# EAGLE design writecard (EAGLE 7.2.0)
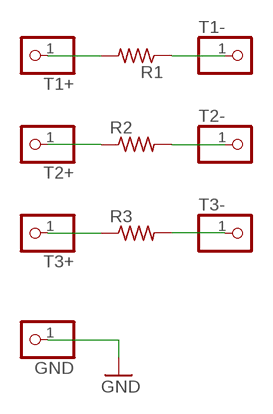
[diagram p0: schematic, sheet 1]

## Parts
GND  PINHD-1X1  [1X01]
R1  R-US_R2512  [R2512]
R2  R-US_R2512  [R2512]
R3  R-US_R2512  [R2512]
T1+  PINHD-1X1  [1X01]
T1-  PINHD-1X1  [1X01]
T2+  PINHD-1X1  [1X01]
T2-  PINHD-1X1  [1X01]
T3+  PINHD-1X1  [1X01]
T3-  PINHD-1X1  [1X01]

## Nets
GND: GND.1
N$1: R1.1 T1-.1
N$2: R1.2 T1+.1
N$3: R3.1 T3+.1
N$4: R2.1 T2+.1
N$5: R2.2 T2-.1
N$6: R3.2 T3-.1

## Library data of the parts
GND T1+ T1- T2+ T2- T3+ T3- = pinhead:PINHD-1X1: PIN HEADER
R1-R3 = resistor:R-US_: RESISTOR, American symbol

## Board
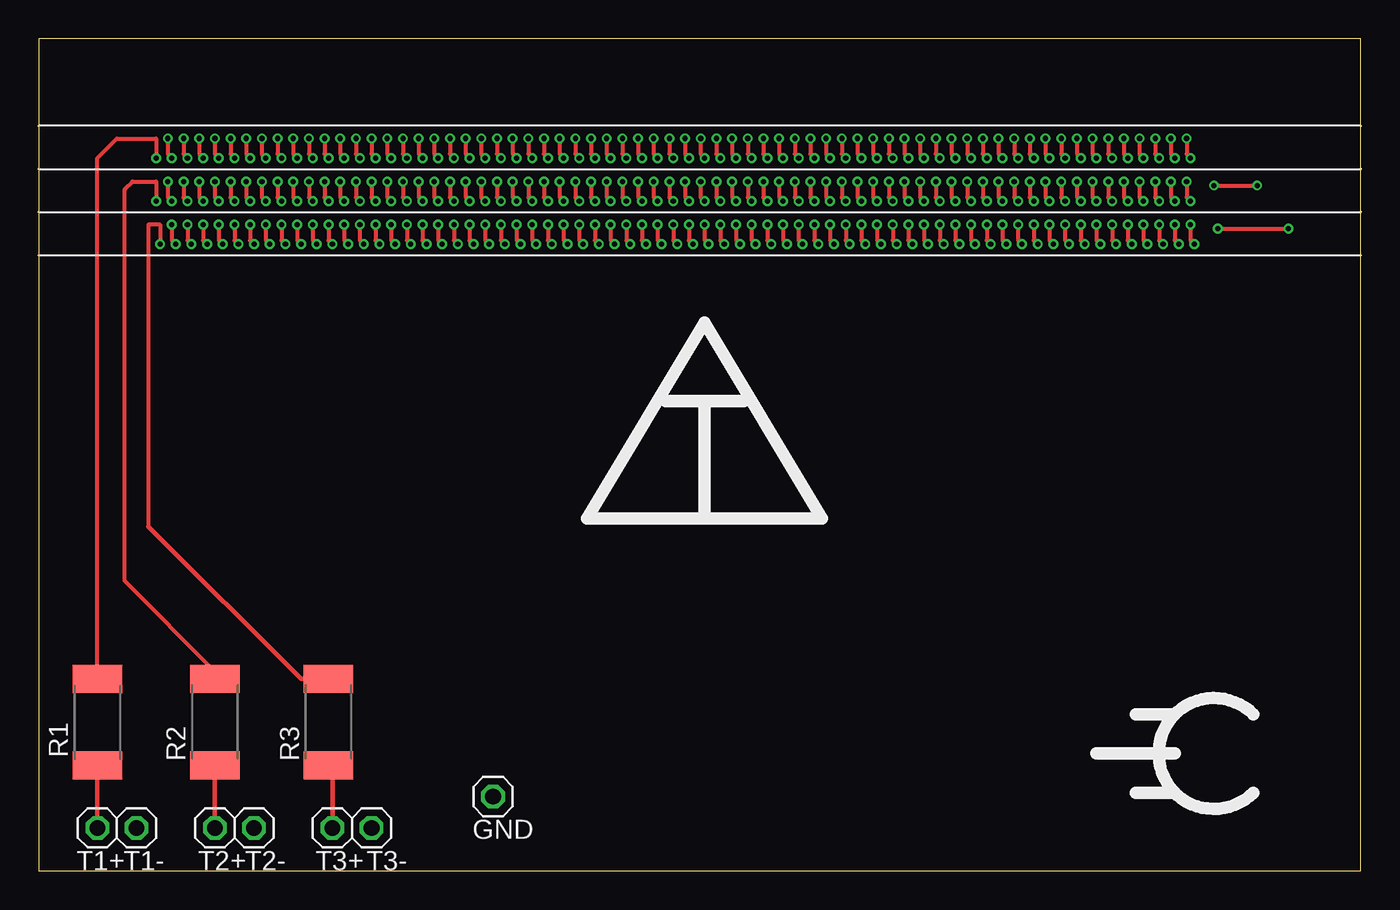
[diagram p1: board, top side]
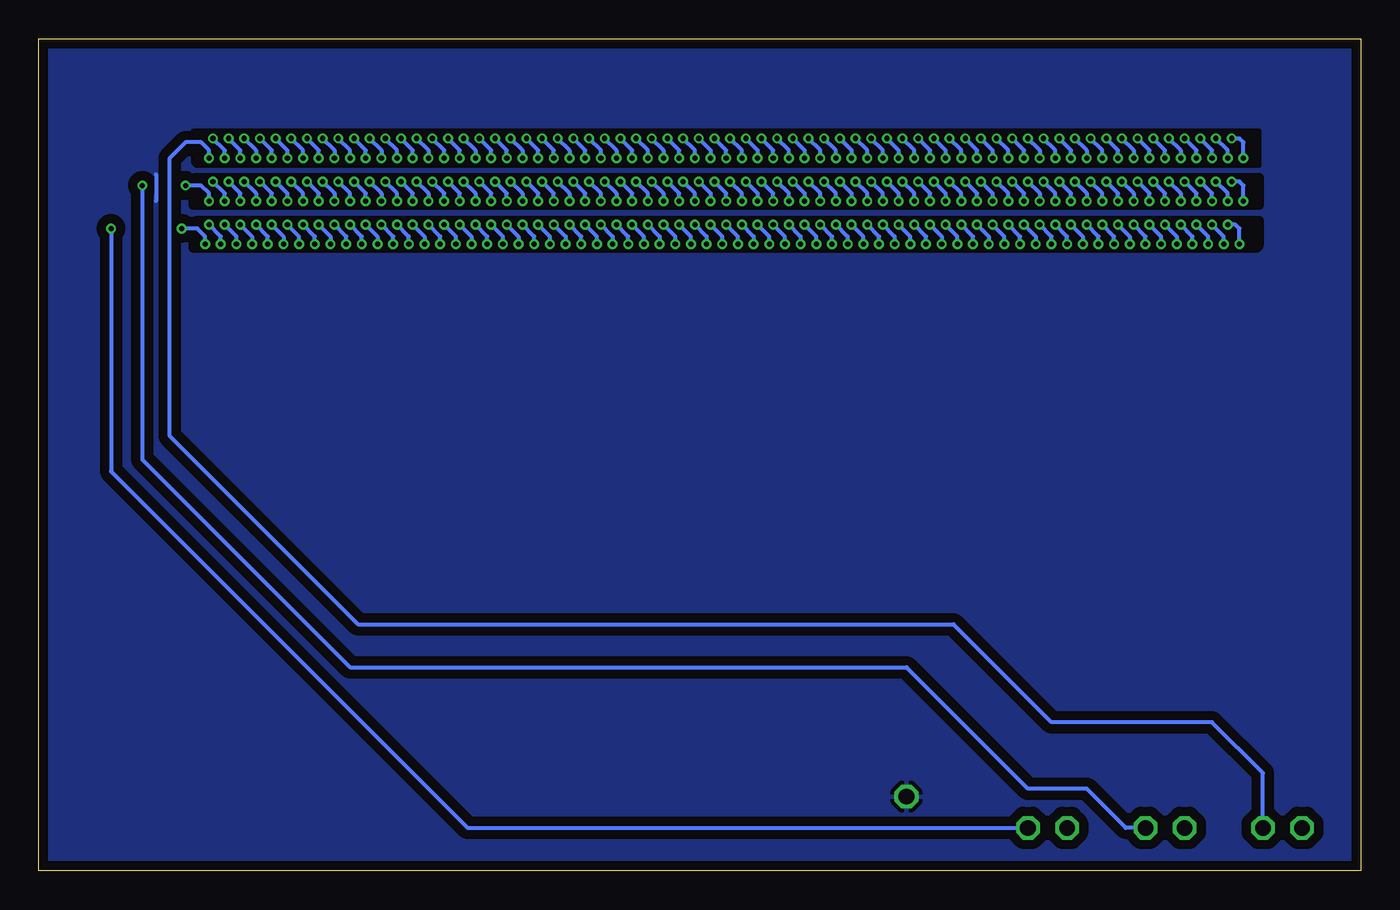
[diagram p2: board, bottom side, seen from below]

Size 85.72 x 53.98 mm. Coordinates in mm from the lower left corner, seen from the top.
Outline: 0,0 85.72,0 85.72,53.98 0,53.98 0,0
Copper layers (1*16): Top 0.035mm / dielectric 1.6mm / Bottom 0.035mm
Design rules "Elecrow_2-layer_PCB_eagle_rule *": minimum track width 6mil, minimum drill 12mil, track to track 8mil, track to pad 8mil, pad to pad 12mil, via to via 12mil, smd to smd 0mil, copper to edge 20mil, drill to drill 10mil, minimum pad ring 6mil, minimum via ring 6mil, stop-mask expansion 0mil, vias tented up to drill 100mil, thermal gap 10mil

### Footprints (pad centres in the part's own frame; a part is rotated, then mirrored left to right if it is on the bottom)
1X01 = drill 1.016 octagon: 1 0,0
R2512 = smd 1.8 x 3.2: 1 -2.8,0; 2 2.8,0

### Placement (x,y rotation side)
GND  29.46,4.83 0 top
R1  3.81,9.65 270 top
R2  11.43,9.65 90 top
R3  18.8,9.65 90 top
T1+  3.81,2.79 0 top
T1-  6.35,2.79 0 top
T2+  11.43,2.79 0 top
T2-  13.97,2.79 0 top
T3+  19.05,2.79 0 top
T3-  21.59,2.79 0 top

### Tracks (layer width: path | path; a pad name or v marks a point on that pad's centre or on a via)
GND
  Bottom 0.254: 78.11,45.16 78.11,43.43
  pour Bottom (isolate 0.61, rank 6): 0,0 0,54.1 85.34,54.1 arc-90 85.6,53.85 85.6,31.75 arc-90 85.6,31.5 85.6,0
  cutout Bottom: 6.6,43.18 6.6,44.96 75.44,44.96 arc-90 75.69,44.7 75.69,43.43 75.69,43.18
  cutout Bottom: 6.6,42.16 75.44,42.16 arc-90 75.69,41.91 75.69,40.39 6.86,40.39 arc-90 6.6,40.64
  pour Bottom (rank 2): 5.33,49.28 5.33,38.86 5.59,38.61 75.69,38.61 75.69,49.02 75.44,49.28
  cutout Bottom: 6.6,48.01 6.6,45.72 75.44,45.72 arc90 75.69,46.23 75.69,48.01
N$1  (via drill 0.33 pad 0.18)
  Top 0.254: v7.62,46.23 7.62,47.5 5.08,47.5 3.81,46.23 R1.1 | v8.38,47.5 8.38,46.48 v8.64,46.23 | v9.4,47.5 9.4,46.48 v9.65,46.23 | v10.41,47.5 10.41,46.48 v10.67,46.23 | v11.43,47.5 11.43,46.48 v11.68,46.23 | v12.45,47.5 12.45,46.48 v12.7,46.23 | v13.46,47.5 13.46,46.48 v13.72,46.23 | v14.48,47.5 14.48,46.48 v14.73,46.23 | v15.49,47.5 15.49,46.48 v15.75,46.23 | v16.51,47.5 16.51,46.48 v16.76,46.23 | v17.53,47.5 17.53,46.48 v17.78,46.23 | v18.54,47.5 18.54,46.48 v18.8,46.23 | v19.56,47.5 19.56,46.48 v19.81,46.23 | v20.57,47.5 20.57,46.48 v20.83,46.23 | v21.59,47.5 21.59,46.48 v21.84,46.23 | v22.61,47.5 22.61,46.48 v22.86,46.23 | v23.62,47.5 23.62,46.48 v23.88,46.23 | v24.64,47.5 24.64,46.48 v24.89,46.23 | v25.65,47.5 25.65,46.48 v25.91,46.23 | v26.67,47.5 26.67,46.48 v26.92,46.23 | v27.69,47.5 27.69,46.48 v27.94,46.23 | v28.7,47.5 28.7,46.48 v28.96,46.23 | v29.72,47.5 29.72,46.48 v29.97,46.23 | v30.73,47.5 30.73,46.48 v30.99,46.23 | v31.75,47.5 31.75,46.48 v32,46.23 | v32.77,47.5 32.77,46.48 v33.02,46.23 | v33.78,47.5 33.78,46.48 v34.04,46.23 | v34.8,47.5 34.8,46.48 v35.05,46.23 | v35.81,47.5 35.81,46.48 v36.07,46.23 | v36.83,47.5 36.83,46.48 v37.08,46.23 | v37.85,47.5 37.85,46.48 v38.1,46.23 | v38.86,47.5 38.86,46.48 v39.12,46.23 | v39.88,47.5 39.88,46.48 v40.13,46.23 | v40.89,47.5 40.89,46.48 v41.15,46.23 | v41.91,47.5 41.91,46.48 v42.16,46.23 | v42.93,47.5 42.93,46.48 v43.18,46.23 | v43.94,47.5 43.94,46.48 v44.2,46.23 | v44.96,47.5 44.96,46.48 v45.21,46.23 | v45.97,47.5 45.97,46.48 v46.23,46.23 | v46.99,47.5 46.99,46.48 v47.24,46.23 | v48.01,47.5 48.01,46.48 v48.26,46.23 | v49.02,47.5 49.02,46.48 v49.28,46.23
  Top 0.254: v50.04,47.5 50.04,46.48 v50.29,46.23 | v51.05,47.5 51.05,46.48 v51.31,46.23 | v52.07,47.5 52.07,46.48 v52.32,46.23 | v53.09,47.5 53.09,46.48 v53.34,46.23 | v54.1,47.5 54.1,46.48 v54.36,46.23 | v55.12,47.5 55.12,46.48 v55.37,46.23 | v56.13,47.5 56.13,46.48 v56.39,46.23 | v57.15,47.5 57.15,46.48 v57.4,46.23 | v58.17,47.5 58.17,46.48 v58.42,46.23 | v59.18,47.5 59.18,46.48 v59.44,46.23 | v60.2,47.5 60.2,46.48 v60.45,46.23 | v61.21,47.5 61.21,46.48 v61.47,46.23 | v62.23,47.5 62.23,46.48 v62.48,46.23 | v63.25,47.5 63.25,46.48 v63.5,46.23 | v64.26,47.5 64.26,46.48 v64.52,46.23 | v65.28,47.5 65.28,46.48 v65.53,46.23 | v66.29,47.5 66.29,46.48 v66.55,46.23 | v67.31,47.5 67.31,46.48 v67.56,46.23 | v68.33,47.5 68.33,46.48 v68.58,46.23 | v69.34,47.5 69.34,46.48 v69.6,46.23 | v70.36,47.5 70.36,46.48 v70.61,46.23 | v71.37,47.5 71.37,46.48 v71.63,46.23 | v72.39,47.5 72.39,46.48 v72.64,46.23 | v73.41,47.5 73.41,46.48 v73.66,46.23 | v74.42,47.5 74.42,46.48 v74.68,46.23
  Bottom 0.254: v7.62,46.23 7.62,47.24 7.87,47.5 v8.38,47.5 | v8.64,46.23 8.64,46.74 v9.4,47.5 | v9.65,46.23 9.65,46.74 v10.41,47.5 | v10.67,46.23 10.67,46.74 v11.43,47.5 | v12.45,47.5 11.68,46.74 v11.68,46.23 | v12.7,46.23 12.7,46.74 v13.46,47.5 | v13.72,46.23 13.72,46.74 v14.48,47.5 | v15.49,47.5 14.73,46.74 v14.73,46.23 | v15.75,46.23 15.75,46.74 v16.51,47.5 | v16.76,46.23 16.76,46.74 v17.53,47.5 | v18.54,47.5 17.78,46.74 v17.78,46.23 | v18.8,46.23 18.8,46.74 v19.56,47.5 | v19.81,46.23 19.81,46.74 v20.57,47.5 | v21.59,47.5 20.83,46.74 v20.83,46.23 | v21.84,46.23 21.84,46.74 v22.61,47.5 | v22.86,46.23 22.86,46.74 v23.62,47.5 | v24.64,47.5 23.88,46.74 v23.88,46.23 | v24.89,46.23 24.89,46.74 v25.65,47.5 | v25.91,46.23 25.91,46.74 v26.67,47.5 | v27.69,47.5 26.92,46.74 v26.92,46.23 | v27.94,46.23 27.94,46.74 v28.7,47.5 | v28.96,46.23 28.96,46.74 v29.72,47.5 | v30.73,47.5 29.97,46.74 v29.97,46.23 | v30.99,46.23 30.99,46.74 v31.75,47.5 | v32,46.23 32,46.74 v32.77,47.5 | v33.78,47.5 33.02,46.74 v33.02,46.23 | v34.04,46.23 34.04,46.74 v34.8,47.5 | v35.05,46.23 35.05,46.74 v35.81,47.5 | v36.83,47.5 36.07,46.74 v36.07,46.23 | v37.08,46.23 37.08,46.74 v37.85,47.5 | v38.1,46.23 38.1,46.74 v38.86,47.5 | v39.88,47.5 39.12,46.74 v39.12,46.23 | v40.13,46.23 40.13,46.74 v40.89,47.5 | v41.15,46.23 41.15,46.74 v41.91,47.5 | v42.93,47.5 42.16,46.74 v42.16,46.23 | v43.18,46.23 43.18,46.74 v43.94,47.5 | v44.2,46.23 44.2,46.74 v44.96,47.5 | v45.97,47.5 45.21,46.74 v45.21,46.23 | v46.23,46.23 46.23,46.74 v46.99,47.5 | v47.24,46.23 47.24,46.74 v48.01,47.5 | v49.02,47.5 48.26,46.74 v48.26,46.23 | v49.28,46.23 49.28,46.74 v50.04,47.5 | v50.29,46.23 50.29,46.74 v51.05,47.5
  Bottom 0.254: v52.07,47.5 51.31,46.74 v51.31,46.23 | v52.32,46.23 52.32,46.74 v53.09,47.5 | v53.34,46.23 53.34,46.74 v54.1,47.5 | v55.12,47.5 54.36,46.74 v54.36,46.23 | v55.37,46.23 55.37,46.74 v56.13,47.5 | v56.39,46.23 56.39,46.74 v57.15,47.5 | v58.17,47.5 57.4,46.74 v57.4,46.23 | v58.42,46.23 58.42,46.74 v59.18,47.5 | v59.44,46.23 59.44,46.74 v60.2,47.5 | v61.21,47.5 60.45,46.74 v60.45,46.23 | v61.47,46.23 61.47,46.74 v62.23,47.5 | v62.48,46.23 62.48,46.74 v63.25,47.5 | v64.26,47.5 63.5,46.74 v63.5,46.23 | v64.52,46.23 64.52,46.74 v65.28,47.5 | v65.53,46.23 65.53,46.74 v66.29,47.5 | v67.31,47.5 66.55,46.74 v66.55,46.23 | v67.56,46.23 67.56,46.74 v68.33,47.5 | v68.58,46.23 68.58,46.74 v69.34,47.5 | v70.36,47.5 69.6,46.74 v69.6,46.23 | v70.61,46.23 70.61,46.74 v71.37,47.5 | v72.39,47.5 71.63,46.74 v71.63,46.23 | v72.64,46.23 72.64,46.74 v73.41,47.5 | v73.66,46.23 73.66,46.74 v74.42,47.5 | v74.68,46.23 74.68,46.74 75.18,47.24 76.2,47.24 77.22,46.23 77.22,28.19 65.02,16 26.42,16 20.07,9.65 9.65,9.65 6.35,6.35 T1-.1
N$2
  Top 0.305: R1.2 T1+.1
N$3
  Top 0.305: R3.1 19.05,6.85 T3+.1
N$4
  Top 0.305: R2.1 T2+.1
N$5  (via drill 0.33 pad 0.18)
  Top 0.254: R2.2 11.43,12.95 5.59,18.8 5.59,44.2 6.1,44.7 7.62,44.7 v7.62,43.43 | v8.38,44.7 8.38,43.69 v8.64,43.43 | v9.4,44.7 9.4,43.69 v9.65,43.43 | v10.41,44.7 10.41,43.69 v10.67,43.43 | v11.43,44.7 11.43,43.69 v11.68,43.43 | v12.45,44.7 12.45,43.69 v12.7,43.43 | v13.46,44.7 13.46,43.69 v13.72,43.43 | v14.48,44.7 14.48,43.69 v14.73,43.43 | v15.49,44.7 15.49,43.69 v15.75,43.43 | v16.51,44.7 16.51,43.69 v16.76,43.43 | v17.53,44.7 17.53,43.69 v17.78,43.43 | v18.54,44.7 18.54,43.69 v18.8,43.43 | v19.56,44.7 19.56,43.69 v19.81,43.43 | v20.57,44.7 20.57,43.69 v20.83,43.43 | v21.59,44.7 21.59,43.69 v21.84,43.43 | v22.61,44.7 22.61,43.69 v22.86,43.43 | v23.62,44.7 23.62,43.69 v23.88,43.43 | v24.64,44.7 24.64,43.69 v24.89,43.43 | v25.65,44.7 25.65,43.69 v25.91,43.43 | v26.67,44.7 26.67,43.69 v26.92,43.43 | v27.69,44.7 27.69,43.69 v27.94,43.43 | v28.7,44.7 28.7,43.69 v28.96,43.43 | v29.72,44.7 29.72,43.69 v29.97,43.43 | v30.73,44.7 30.73,43.69 v30.99,43.43 | v31.75,44.7 31.75,43.69 v32,43.43 | v32.77,44.7 32.77,43.69 v33.02,43.43 | v33.78,44.7 33.78,43.69 v34.04,43.43 | v34.8,44.7 34.8,43.69 v35.05,43.43 | v35.81,44.7 35.81,43.69 v36.07,43.43 | v36.83,44.7 36.83,43.69 v37.08,43.43 | v37.85,44.7 37.85,43.69 v38.1,43.43 | v38.86,44.7 38.86,43.69 v39.12,43.43 | v39.88,44.7 39.88,43.69 v40.13,43.43 | v40.89,44.7 40.89,43.69 v41.15,43.43 | v41.91,44.7 41.91,43.69 v42.16,43.43 | v42.93,44.7 42.93,43.69 v43.18,43.43 | v43.94,44.7 43.94,43.69 v44.2,43.43 | v44.96,44.7 44.96,43.69 v45.21,43.43 | v45.97,44.7 45.97,43.69 v46.23,43.43 | v46.99,44.7 46.99,43.69 v47.24,43.43 | v48.01,44.7 48.01,43.69 v48.26,43.43 | v49.02,44.7 49.02,43.69 v49.28,43.43
  Top 0.254: v50.04,44.7 50.04,43.69 v50.29,43.43 | v51.05,44.7 51.05,43.69 v51.31,43.43 | v52.07,44.7 52.07,43.69 v52.32,43.43 | v53.09,44.7 53.09,43.69 v53.34,43.43 | v54.1,44.7 54.1,43.69 v54.36,43.43 | v55.12,44.7 55.12,43.69 v55.37,43.43 | v56.13,44.7 56.13,43.69 v56.39,43.43 | v57.15,44.7 57.15,43.69 v57.4,43.43 | v58.17,44.7 58.17,43.69 v58.42,43.43 | v59.18,44.7 59.18,43.69 v59.44,43.43 | v60.2,44.7 60.2,43.69 v60.45,43.43 | v61.21,44.7 61.21,43.69 v61.47,43.43 | v62.23,44.7 62.23,43.69 v62.48,43.43 | v63.25,44.7 63.25,43.69 v63.5,43.43 | v64.26,44.7 64.26,43.69 v64.52,43.43 | v65.28,44.7 65.28,43.69 v65.53,43.43 | v66.29,44.7 66.29,43.69 v66.55,43.43 | v67.31,44.7 67.31,43.69 v67.56,43.43 | v68.33,44.7 68.33,43.69 v68.58,43.43 | v69.34,44.7 69.34,43.69 v69.6,43.43 | v70.36,44.7 70.36,43.69 v70.61,43.43 | v71.37,44.7 71.37,43.69 v71.63,43.43 | v72.39,44.7 72.39,43.69 v72.64,43.43 | v73.41,44.7 73.41,43.69 v73.66,43.43 | v74.42,44.7 74.42,43.69 v74.68,43.43 | v76.2,44.45 v78.99,44.45
  Bottom 0.254: v7.62,43.43 7.62,44.45 7.87,44.7 v8.38,44.7 | v8.64,43.43 8.64,43.94 v9.4,44.7 | v9.65,43.43 9.65,43.94 v10.41,44.7 | v10.67,43.43 10.67,43.94 v11.43,44.7 | v12.45,44.7 11.68,43.94 v11.68,43.43 | v12.7,43.43 12.7,43.94 v13.46,44.7 | v13.72,43.43 13.72,43.94 v14.48,44.7 | v15.49,44.7 14.73,43.94 v14.73,43.43 | v15.75,43.43 15.75,43.94 v16.51,44.7 | v16.76,43.43 16.76,43.94 v17.53,44.7 | v18.54,44.7 17.78,43.94 v17.78,43.43 | v18.8,43.43 18.8,43.94 v19.56,44.7 | v19.81,43.43 19.81,43.94 v20.57,44.7 | v21.59,44.7 20.83,43.94 v20.83,43.43 | v21.84,43.43 21.84,43.94 v22.61,44.7 | v22.86,43.43 22.86,43.94 v23.62,44.7 | v24.64,44.7 23.88,43.94 v23.88,43.43 | v24.89,43.43 24.89,43.94 v25.65,44.7 | v25.91,43.43 25.91,43.94 v26.67,44.7 | v27.69,44.7 26.92,43.94 v26.92,43.43 | v27.94,43.43 27.94,43.94 v28.7,44.7 | v28.96,43.43 28.96,43.94 v29.72,44.7 | v30.73,44.7 29.97,43.94 v29.97,43.43 | v30.99,43.43 30.99,43.94 v31.75,44.7 | v32,43.43 32,43.94 v32.77,44.7 | v33.78,44.7 33.02,43.94 v33.02,43.43 | v34.04,43.43 34.04,43.94 v34.8,44.7 | v35.05,43.43 35.05,43.94 v35.81,44.7 | v36.83,44.7 36.07,43.94 v36.07,43.43 | v37.08,43.43 37.08,43.94 v37.85,44.7 | v38.1,43.43 38.1,43.94 v38.86,44.7 | v39.88,44.7 39.12,43.94 v39.12,43.43 | v40.13,43.43 40.13,43.94 v40.89,44.7 | v41.15,43.43 41.15,43.94 v41.91,44.7 | v42.93,44.7 42.16,43.94 v42.16,43.43 | v43.18,43.43 43.18,43.94 v43.94,44.7 | v44.2,43.43 44.2,43.94 v44.96,44.7 | v45.97,44.7 45.21,43.94 v45.21,43.43 | v46.23,43.43 46.23,43.94 v46.99,44.7 | v47.24,43.43 47.24,43.94 v48.01,44.7 | v49.02,44.7 48.26,43.94 v48.26,43.43 | v49.28,43.43 49.28,43.94 v50.04,44.7 | v50.29,43.43 50.29,43.94 v51.05,44.7
  Bottom 0.254: v52.07,44.7 51.31,43.94 v51.31,43.43 | v52.32,43.43 52.32,43.94 v53.09,44.7 | v53.34,43.43 53.34,43.94 v54.1,44.7 | v55.12,44.7 54.36,43.94 v54.36,43.43 | v55.37,43.43 55.37,43.94 v56.13,44.7 | v56.39,43.43 56.39,43.94 v57.15,44.7 | v58.17,44.7 57.4,43.94 v57.4,43.43 | v58.42,43.43 58.42,43.94 v59.18,44.7 | v59.44,43.43 59.44,43.94 v60.2,44.7 | v61.21,44.7 60.45,43.94 v60.45,43.43 | v61.47,43.43 61.47,43.94 v62.23,44.7 | v62.48,43.43 62.48,43.94 v63.25,44.7 | v64.26,44.7 63.5,43.94 v63.5,43.43 | v64.52,43.43 64.52,43.94 v65.28,44.7 | v65.53,43.43 65.53,43.94 v66.29,44.7 | v67.31,44.7 66.55,43.94 v66.55,43.43 | v67.56,43.43 67.56,43.94 v68.33,44.7 | v68.58,43.43 68.58,43.94 v69.34,44.7 | v70.36,44.7 69.6,43.94 v69.6,43.43 | v70.61,43.43 70.61,43.94 v71.37,44.7 | v72.39,44.7 71.63,43.94 v71.63,43.43 | v72.64,43.43 72.64,43.94 v73.41,44.7 | v73.66,43.43 73.66,43.94 v74.42,44.7 | v74.68,43.43 74.68,43.94 75.18,44.45 v76.2,44.45 | v78.99,44.45 78.99,26.67 65.53,13.21 29.46,13.21 21.59,5.33 17.78,5.33 15.24,2.79 T2-.1
N$6  (via drill 0.33 pad 0.18)
  Top 0.254: v7.87,40.64 7.87,41.91 7.11,41.91 7.11,22.35 | v8.64,41.91 8.64,40.89 v8.89,40.64 | v9.65,41.91 9.65,40.89 v9.91,40.64 | v10.67,41.91 10.67,40.89 v10.92,40.64 | v11.68,41.91 11.68,40.89 v11.94,40.64 | v12.7,41.91 12.7,40.89 v12.95,40.64 | v13.72,41.91 13.72,40.89 v13.97,40.64 | v14.73,41.91 14.73,40.89 v14.99,40.64 | v15.75,41.91 15.75,40.89 v16,40.64 | v16.76,41.91 16.76,40.89 v17.02,40.64 | v17.78,41.91 17.78,40.89 v18.03,40.64 | v18.8,41.91 18.8,40.89 v19.05,40.64 | v19.81,41.91 19.81,40.89 v20.07,40.64 | v20.83,41.91 20.83,40.89 v21.08,40.64 | v21.84,41.91 21.84,40.89 v22.1,40.64 | v22.86,41.91 22.86,40.89 v23.11,40.64 | v23.88,41.91 23.88,40.89 v24.13,40.64 | v24.89,41.91 24.89,40.89 v25.15,40.64 | v25.91,41.91 25.91,40.89 v26.16,40.64 | v26.92,41.91 26.92,40.89 v27.18,40.64 | v27.94,41.91 27.94,40.89 v28.19,40.64 | v28.96,41.91 28.96,40.89 v29.21,40.64 | v29.97,41.91 29.97,40.89 v30.23,40.64 | v30.99,41.91 30.99,40.89 v31.24,40.64 | v32,41.91 32,40.89 v32.26,40.64 | v33.02,41.91 33.02,40.89 v33.27,40.64 | v34.04,41.91 34.04,40.89 v34.29,40.64 | v35.05,41.91 35.05,40.89 v35.31,40.64 | v36.07,41.91 36.07,40.89 v36.32,40.64 | v37.08,41.91 37.08,40.89 v37.34,40.64 | v38.1,41.91 38.1,40.89 v38.35,40.64 | v39.12,41.91 39.12,40.89 v39.37,40.64 | v40.13,41.91 40.13,40.89 v40.39,40.64 | v41.15,41.91 41.15,40.89 v41.4,40.64 | v42.16,41.91 42.16,40.89 v42.42,40.64 | v43.18,41.91 43.18,40.89 v43.43,40.64 | v44.2,41.91 44.2,40.89 v44.45,40.64 | v45.21,41.91 45.21,40.89 v45.47,40.64 | v46.23,41.91 46.23,40.89 v46.48,40.64 | v47.24,41.91 47.24,40.89 v47.5,40.64 | v48.26,41.91 48.26,40.89 v48.51,40.64 | v49.28,41.91 49.28,40.89 v49.53,40.64
  Top 0.254: v50.29,41.91 50.29,40.89 v50.55,40.64 | v51.31,41.91 51.31,40.89 v51.56,40.64 | v52.32,41.91 52.32,40.89 v52.58,40.64 | v53.34,41.91 53.34,40.89 v53.59,40.64 | v54.36,41.91 54.36,40.89 v54.61,40.64 | v55.37,41.91 55.37,40.89 v55.63,40.64 | v56.39,41.91 56.39,40.89 v56.64,40.64 | v57.4,41.91 57.4,40.89 v57.66,40.64 | v58.42,41.91 58.42,40.89 v58.67,40.64 | v59.44,41.91 59.44,40.89 v59.69,40.64 | v60.45,41.91 60.45,40.89 v60.71,40.64 | v61.47,41.91 61.47,40.89 v61.72,40.64 | v62.48,41.91 62.48,40.89 v62.74,40.64 | v63.5,41.91 63.5,40.89 v63.75,40.64 | v64.52,41.91 64.52,40.89 v64.77,40.64 | v65.53,41.91 65.53,40.89 v65.79,40.64 | v66.55,41.91 66.55,40.89 v66.8,40.64 | v67.56,41.91 67.56,40.89 v67.82,40.64 | v68.58,41.91 68.58,40.89 v68.83,40.64 | v69.6,41.91 69.6,40.89 v69.85,40.64 | v70.61,41.91 70.61,40.89 v70.87,40.64 | v71.63,41.91 71.63,40.89 v71.88,40.64 | v72.64,41.91 72.64,40.89 v72.9,40.64 | v73.66,41.91 73.66,40.89 v73.91,40.64 | v74.68,41.91 74.68,40.89 v74.93,40.64 | v76.45,41.66 v81.03,41.66
  Top 0.305: 7.11,22.35 17.01,12.45 R3.2
  Bottom 0.254: v7.87,40.64 7.87,41.66 8.13,41.91 v8.64,41.91 | v8.89,40.64 8.89,41.15 v9.65,41.91 | v9.91,40.64 9.91,41.15 v10.67,41.91 | v10.92,40.64 10.92,41.15 v11.68,41.91 | v12.7,41.91 11.94,41.15 v11.94,40.64 | v12.95,40.64 12.95,41.15 v13.72,41.91 | v13.97,40.64 13.97,41.15 v14.73,41.91 | v15.75,41.91 14.99,41.15 v14.99,40.64 | v16,40.64 16,41.15 v16.76,41.91 | v17.02,40.64 17.02,41.15 v17.78,41.91 | v18.8,41.91 18.03,41.15 v18.03,40.64 | v19.05,40.64 19.05,41.15 v19.81,41.91 | v20.07,40.64 20.07,41.15 v20.83,41.91 | v21.84,41.91 21.08,41.15 v21.08,40.64 | v22.1,40.64 22.1,41.15 v22.86,41.91 | v23.11,40.64 23.11,41.15 v23.88,41.91 | v24.89,41.91 24.13,41.15 v24.13,40.64 | v25.15,40.64 25.15,41.15 v25.91,41.91 | v26.16,40.64 26.16,41.15 v26.92,41.91 | v27.94,41.91 27.18,41.15 v27.18,40.64 | v28.19,40.64 28.19,41.15 v28.96,41.91 | v29.21,40.64 29.21,41.15 v29.97,41.91 | v30.99,41.91 30.23,41.15 v30.23,40.64 | v31.24,40.64 31.24,41.15 v32,41.91 | v32.26,40.64 32.26,41.15 v33.02,41.91 | v34.04,41.91 33.27,41.15 v33.27,40.64 | v34.29,40.64 34.29,41.15 v35.05,41.91 | v35.31,40.64 35.31,41.15 v36.07,41.91 | v37.08,41.91 36.32,41.15 v36.32,40.64 | v37.34,40.64 37.34,41.15 v38.1,41.91 | v38.35,40.64 38.35,41.15 v39.12,41.91 | v40.13,41.91 39.37,41.15 v39.37,40.64 | v40.39,40.64 40.39,41.15 v41.15,41.91 | v41.4,40.64 41.4,41.15 v42.16,41.91 | v43.18,41.91 42.42,41.15 v42.42,40.64 | v43.43,40.64 43.43,41.15 v44.2,41.91 | v44.45,40.64 44.45,41.15 v45.21,41.91 | v46.23,41.91 45.47,41.15 v45.47,40.64 | v46.48,40.64 46.48,41.15 v47.24,41.91 | v47.5,40.64 47.5,41.15 v48.26,41.91 | v49.28,41.91 48.51,41.15 v48.51,40.64
  Bottom 0.254: v49.53,40.64 49.53,41.15 v50.29,41.91 | v50.55,40.64 50.55,41.15 v51.31,41.91 | v52.32,41.91 51.56,41.15 v51.56,40.64 | v52.58,40.64 52.58,41.15 v53.34,41.91 | v53.59,40.64 53.59,41.15 v54.36,41.91 | v55.37,41.91 54.61,41.15 v54.61,40.64 | v55.63,40.64 55.63,41.15 v56.39,41.91 | v56.64,40.64 56.64,41.15 v57.4,41.91 | v58.42,41.91 57.66,41.15 v57.66,40.64 | v58.67,40.64 58.67,41.15 v59.44,41.91 | v59.69,40.64 59.69,41.15 v60.45,41.91 | v61.47,41.91 60.71,41.15 v60.71,40.64 | v61.72,40.64 61.72,41.15 v62.48,41.91 | v62.74,40.64 62.74,41.15 v63.5,41.91 | v64.52,41.91 63.75,41.15 v63.75,40.64 | v64.77,40.64 64.77,41.15 v65.53,41.91 | v65.79,40.64 65.79,41.15 v66.55,41.91 | v67.56,41.91 66.8,41.15 v66.8,40.64 | v67.82,40.64 67.82,41.15 v68.58,41.91 | v68.83,40.64 68.83,41.15 v69.6,41.91 | v70.61,41.91 69.85,41.15 v69.85,40.64 | v70.87,40.64 70.87,41.15 v71.63,41.91 | v72.64,41.91 71.88,41.15 v71.88,40.64 | v72.9,40.64 72.9,41.15 v73.66,41.91 | v73.91,40.64 73.91,41.15 v74.68,41.91 | v74.93,40.64 74.93,41.15 75.44,41.66 v76.45,41.66 | v81.03,41.66 81.03,25.91 57.91,2.79 T3-.1